# EAGLE design godwit-v01 (EAGLE 6.4)
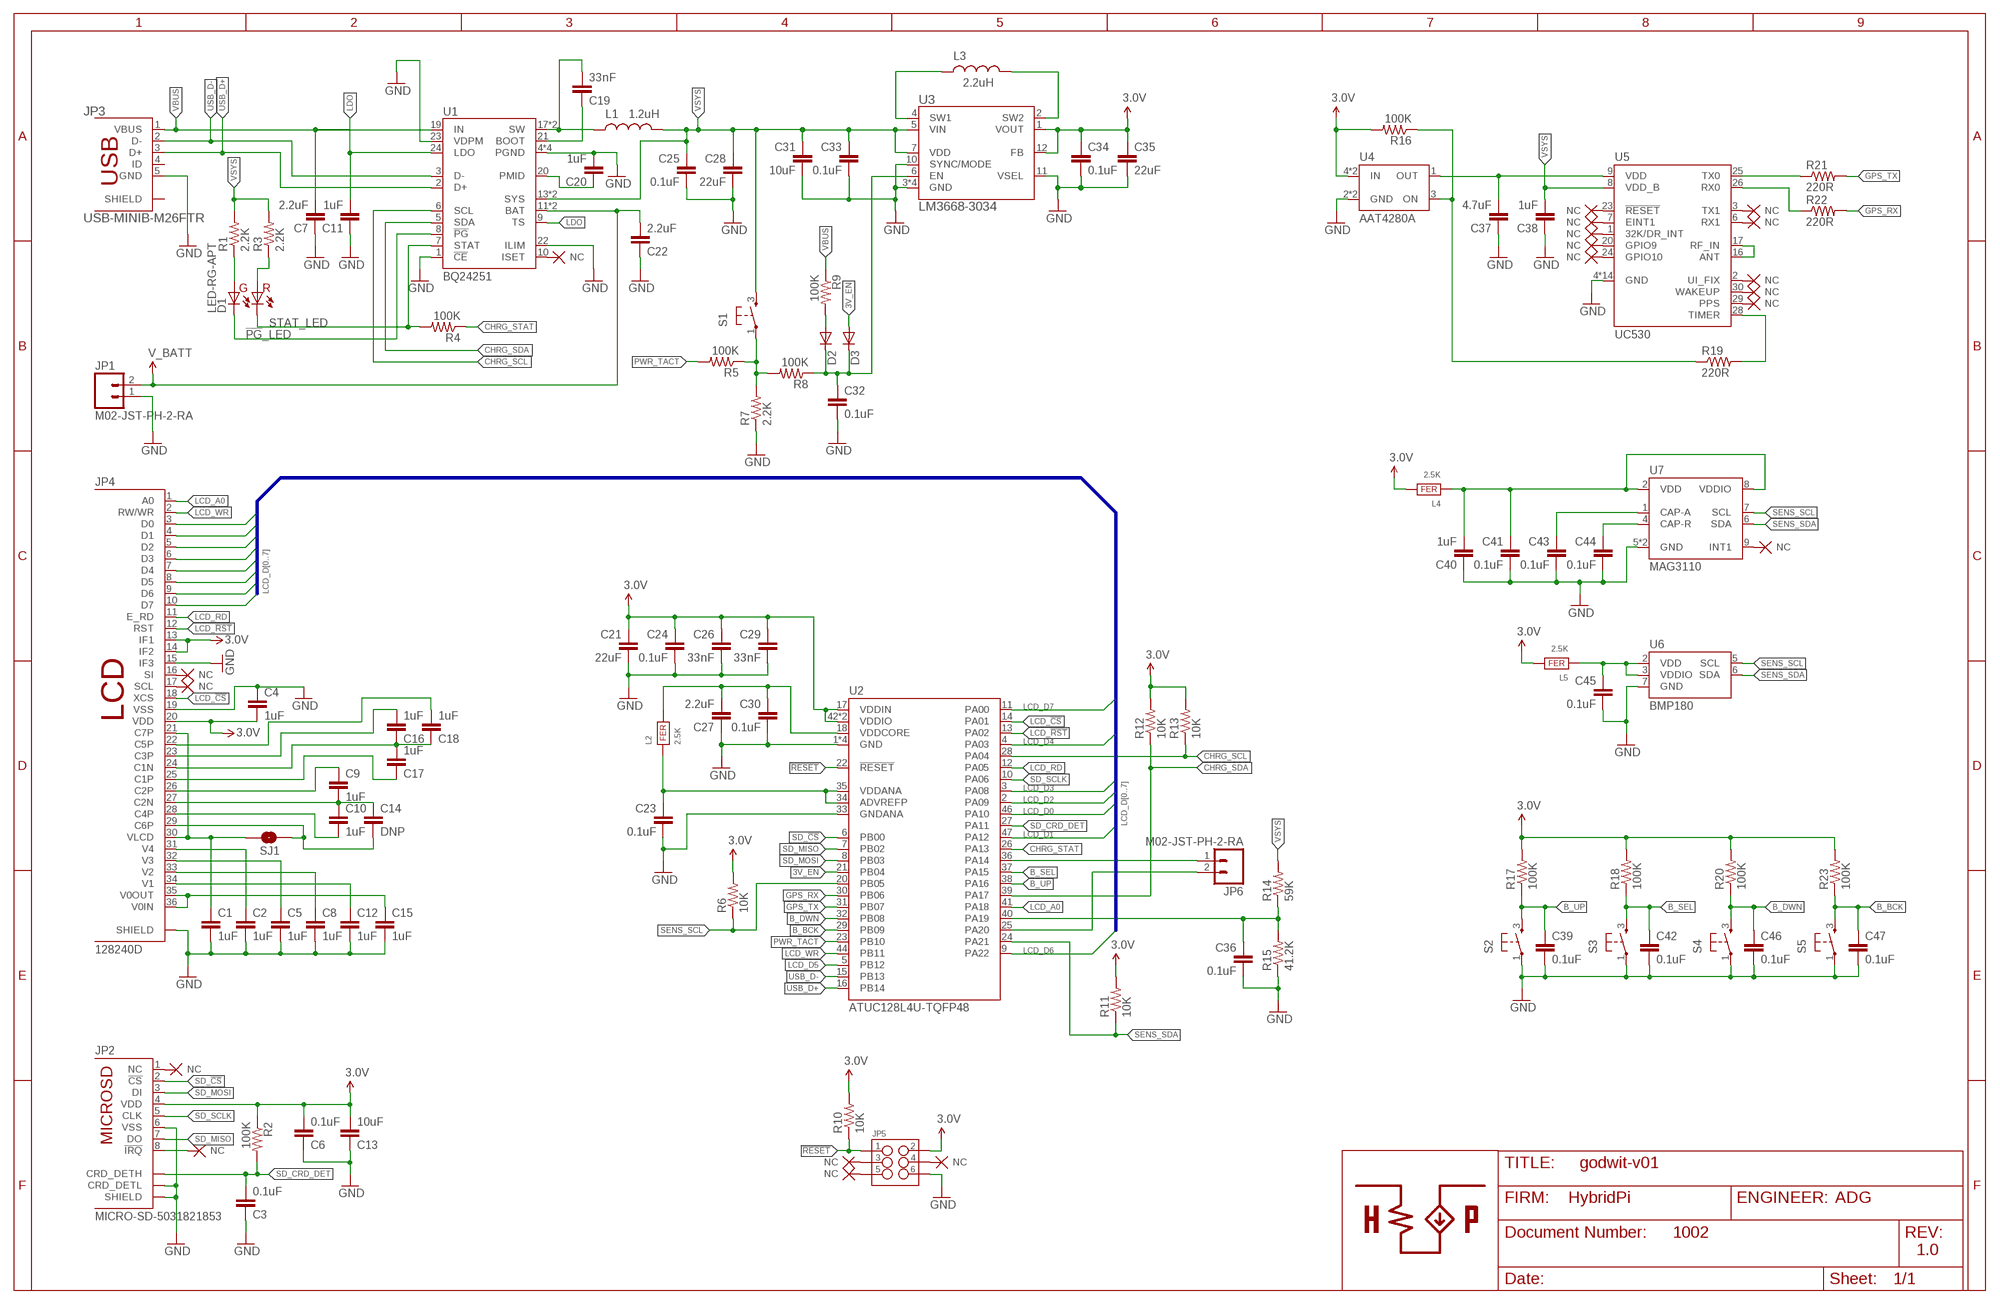
[diagram p0: schematic, sheet 1]

## Parts
C1  1uF  C-EUC0603  [C0603]
C2  1uF  C-EUC0603  [C0603]
C3  0.1uF  C-EUC0603  [C0603]
C4  1uF  C-EUC0603  [C0603]
C5  1uF  C-EUC0603  [C0603]
C6  0.1uF  C-EUC0603  [C0603]
C7  2.2uF  C-EUC0603  [C0603]
C8  1uF  C-EUC0603  [C0603]
C9  1uF  C-EUC0603  [C0603]
C10  1uF  C-EUC0603  [C0603]
C11  1uF  C-EUC0603  [C0603]
C12  1uF  C-EUC0603  [C0603]
C13  10uF  C-EUC0805  [C0805]
C14  DNP  C-EUC0603  [C0603]
C15  1uF  C-EUC0603  [C0603]
C16  1uF  C-EUC0603  [C0603]
C17  1uF  C-EUC0603  [C0603]
C18  1uF  C-EUC0603  [C0603]
C19  33nF  C-EUC0603  [C0603]
C20  1uF  C-EUC0603  [C0603]
C21  22uF  C-EUC0805  [C0805]
C22  2.2uF  C-EUC0603  [C0603]
C23  0.1uF  C-EUC0603  [C0603]
C24  0.1uF  C-EUC0603  [C0603]
C25  0.1uF  C-EUC0603  [C0603]
C26  33nF  C-EUC0603  [C0603]
C27  2.2uF  C-EUC0603  [C0603]
C28  22uF  C-EUC0805  [C0805]
C29  33nF  C-EUC0603  [C0603]
C30  0.1uF  C-EUC0603  [C0603]
C31  10uF  C-EUC0805  [C0805]
C32  0.1uF  C-EUC0603  [C0603]
C33  0.1uF  C-EUC0603  [C0603]
C34  0.1uF  C-EUC0603  [C0603]
C35  22uF  C-EUC0805  [C0805]
C36  0.1uF  C-EUC0603  [C0603]
C37  4.7uF  C-EUC0603  [C0603]
C38  1uF  C-EUC0603  [C0603]
C39  0.1uF  C-EUC0603  [C0603]
C40  1uF  C-EUC0603  [C0603]
C41  0.1uF  C-EUC0603  [C0603]
C42  0.1uF  C-EUC0603  [C0603]
C43  0.1uF  C-EUC0603  [C0603]
C44  0.1uF  C-EUC0603  [C0603]
C45  0.1uF  C-EUC0603  [C0603]
C46  0.1uF  C-EUC0603  [C0603]
C47  0.1uF  C-EUC0603  [C0603]
D1  LED-RG-APT  [LED-2-1.6X1.25]
D2  1N4148X-TP  DIODESOD523  [SOD523]
D3  1N4148X-TP  DIODESOD523  [SOD523]
JP1  M02-JST-PH-2-RA  [JST-PH-2-RA]
JP2  MICRO-SD-5031821853  [MICROSD-5031821853]
JP3  USB-MINIB-M26FTR  [USB-MINIB-M26FTR]
JP4  128240D  [128240D]
JP5  M03X2NO_SILK  [2X3-NS]
JP6  M02-JST-PH-2-RA  [JST-PH-2-RA]
L1  1.2uH  INDUCTOR-SRU5028  [SRU5028]
L2  2.5K  FERRITE-BEAD-0603  [0603]
L3  2.2uH  INDUCTOR-SRU5028  [SRU5028]
L4  2.5K  FERRITE-BEAD-0603  [0603]
L5  2.5K  FERRITE-BEAD-0603  [0603]
R1  2.2K  R-US_R0603  [R0603]
R2  100K  R-US_R0603  [R0603]
R3  2.2K  R-US_R0603  [R0603]
R4  100K  R-US_R0603  [R0603]
R5  100K  R-US_R0603  [R0603]
R6  10K  R-US_R0603  [R0603]
R7  2.2K  R-US_R0603  [R0603]
R8  100K  R-US_R0603  [R0603]
R9  100K  R-US_R0603  [R0603]
R10  10K  R-US_R0603  [R0603]
R11  10K  R-US_R0603  [R0603]
R12  10K  R-US_R0603  [R0603]
R13  10K  R-US_R0603  [R0603]
R14  59K  R-US_R0603  [R0603]
R15  41.2K  R-US_R0603  [R0603]
R16  100K  R-US_R0603  [R0603]
R17  100K  R-US_R0603  [R0603]
R18  100K  R-US_R0603  [R0603]
R19  220R  R-US_R0603  [R0603]
R20  100K  R-US_R0603  [R0603]
R21  220R  R-US_R0603  [R0603]
R22  220R  R-US_R0603  [R0603]
R23  100K  R-US_R0603  [R0603]
S1  FSMRA7JH  TAC_SWITCH-FSMRA  [FSMRA]
S2  FSMRA7JH  TAC_SWITCH-FSMRA  [FSMRA]
S3  FSMRA7JH  TAC_SWITCH-FSMRA  [FSMRA]
S4  FSMRA7JH  TAC_SWITCH-FSMRA  [FSMRA]
S5  FSMRA7JH  TAC_SWITCH-FSMRA  [FSMRA]
SJ1  SOLDERJUMPERNC  [SJ_2S]
U1  BQ24251  [VQFN-24]
U2  ATUC128L4U-TQFP48  [TQFP48]
U3  LM3668-3034  [WSON-12]
U4  AAT4280A  [SOT23-6]
U5  UC530  [UC530]
U6  BMP180  [BMP180]
U7  MAG3110  [DFN-10-2X2]
U$2  NC  (no package)
U$3  NC  (no package)
U$4  NC  (no package)
U$5  NC  (no package)
U$6  NC  (no package)
U$7  NC  (no package)
U$8  NC  (no package)
U$9  NC  (no package)
U$10  NC  (no package)
U$11  NC  (no package)
U$12  NC  (no package)
U$13  NC  (no package)
U$14  NC  (no package)
U$16  NC  (no package)
U$17  NC  (no package)
U$18  NC  (no package)
U$19  NC  (no package)
U$20  NC  (no package)
U$80  NC  (no package)

## Nets
3.0V: C4.2 C6.2 C13.2 C21.1 C24.1 C26.1 C29.1 C34.1 C35.1 JP2.4(VDD) JP4.13(IF1) JP4.14(IF2) JP4.20(VDD) JP5.2 L4.2 L5.2 R2.1 R6.2 R10.2 R11.2 R12.2 R13.2 R16.2 R17.2 R18.2 R20.2 R23.2 U2.17(VDDIN) U2.42(VDDIO) U2.48(VDDIO) U3.1(VOUT) U3.12(FB) U4.4(IN) U4.6(IN)
3V_EN: D3.A U2.21(PB04)
!PG!_LED: D1.4(CG) U1.8(!PG!)
!RESET!: JP5.1 R10.1 U2.22(!RESET!)
B_BCK: C47.1 R23.1 S5.3 U2.29(PB09)
B_DWN: C46.1 R20.1 S4.3 U2.32(PB08)
B_SEL: C42.1 R18.1 S3.3 U2.37(PA15)
B_UP: C39.1 R17.1 S2.3 U2.38(PA16)
CHRG_SCL: R13.1 U1.6(SCL) U2.28(PA04)
CHRG_SDA: R12.1 U1.5(SDA) U2.39(PA17)
CHRG_STAT: R4.1 U2.26(PA13)
GND: C1.2 C2.2 C3.1 C4.1 C5.2 C6.1 C7.1 C8.2 C11.1 C12.2 C13.1 C15.2 C20.2 C21.2 C22.1 C23.2 C24.2 C25.2 C26.2 C27.1 C28.2 C29.2 C30.2 C31.2 C32.2 C33.2 C34.2 C35.2 C36.2 C37.1 C38.1 C39.2 C40.1 C41.2 C42.2 C43.2 C44.2 C45.2 C46.2 C47.2 JP1.1 JP2.6(VSS) JP2.CRD_DETL JP2.SHIELD1(SHIELD) JP2.SHIELD2(SHIELD) JP2.SHIELD3(SHIELD) JP2.SHIELD4(SHIELD) JP2.SHIELD5(SHIELD) JP3.5(GND) JP4.15(IF3) JP4.19(VSS) JP4.SHIELD1(SHIELD) JP4.SHIELD2(SHIELD) JP5.6 R7.1 R15.1 S2.1 S3.1 S4.1 S5.1 U1.1(!CE!) U1.4(PGND) U1.15(PGND) U1.16(PGND) U1.22(ILIM) U1.23(VDPM) U1.PAD(PGND) U2.1(GND) U2.19(GND) U2.33(GNDANA) U2.43(GND) U2.45(GND) U3.3(GND) U3.8(GND) U3.9(GND) U3.10(SYNC/MODE) U3.11(VSEL) U3.PAD(GND) U4.2(GND) U4.5(GND) U5.4(GND) U5.5(GND) U5.10(GND) U5.11(GND) U5.12(GND) U5.13(GND) U5.14(GND) U5.15(GND) U5.18(GND) U5.19(GND) U5.21(GND) U5.22(GND) U5.27(GND) U5.31(GND) U6.7(GND) U7.5(GND) U7.10(GND)
GPS_RX: R22.2 U2.30(PB06)
GPS_TX: R21.2 U2.31(PB07)
LCD_!CS!: JP4.18(XCS) U2.14(PA01)
LCD_!RST!: JP4.12(RST) U2.13(PA02)
LCD_A0: JP4.1(A0) U2.41(PA18)
LCD_D0: JP4.3(D0) U2.46(PA10)
LCD_D1: JP4.4(D1) U2.47(PA12)
LCD_D2: JP4.5(D2) U2.2(PA09)
LCD_D3: JP4.6(D3) U2.3(PA08)
LCD_D4: JP4.7(D4) U2.4(PA03)
LCD_D5: JP4.8(D5) U2.5(PB12)
LCD_D6: JP4.9(D6) U2.9(PA22)
LCD_D7: JP4.10(D7) U2.11(PA00)
LCD_RD: JP4.11(E_RD) U2.12(PA05)
LCD_WR: JP4.2(RW/WR) U2.44(PB11)
LDO: C11.2 U1.9(TS) U1.24(LDO)
N$1: L3.2 U3.2(SW2)
N$2: L3.1 U3.4(SW1)
N$3: C19.1 U1.21(BOOT)
N$4: U5.16(ANT) U5.17(RF_IN)
N$5: C19.2 L1.1 U1.17(SW) U1.18(SW)
N$6: C20.1 U1.20(PMID)
N$7: U1.10(ISET) U$80.NC
N$8: D2.A R9.2
N$9: C32.1 D2.C D3.C R8.1 U3.6(EN)
N$10: U5.3(TX1) U$2.NC
N$11: U5.6(RX1) U$3.NC
N$12: U5.29(PPS) U$4.NC
N$13: U5.7(EINT1) U$5.NC
N$14: U5.1(32K/DR_INT) U$6.NC
N$15: D1.3(AG) R1.1
N$16: U5.20(GPIO9) U$7.NC
N$17: U5.24(GPIO10) U$8.NC
N$18: D1.1(AR) R3.1
N$19: U5.30(WAKEUP) U$11.NC
N$20: U5.2(UI_FIX) U$9.NC
N$21: U5.23(!RESET!) U$10.NC
N$22: C37.2 U4.1(OUT) U5.9(VDD)
N$23: R21.1 U5.25(TX0)
N$24: R22.1 U5.26(RX0)
N$25: R19.2 U5.28(TIMER)
N$26: R16.1 R19.1 U4.3(ON)
N$27: C9.2 C10.1 C14.1 JP4.27(C2N)
N$28: C44.1 U7.4(CAP-R)
N$29: C43.1 U7.1(CAP-A)
N$30: JP2.1(NC) U$13.NC
N$31: JP2.8(!IRQ!) U$14.NC
N$32: U7.9(INT1) U$12.NC
N$33: C9.1 JP4.26(C2P)
N$34: C10.2 JP4.28(C4P)
N$35: C14.2 JP4.29(C6P) SJ1.2
N$36: C16.1 C17.2 C18.1 JP4.24(C1N)
N$37: C17.1 JP4.25(C1P)
N$38: C16.2 JP4.23(C3P)
N$39: C18.2 JP4.22(C5P)
N$40: C2.1 JP4.31(V4)
N$41: C5.1 JP4.32(V3)
N$42: C1.1 JP4.21(C7P) JP4.30(VLCD) SJ1.1
N$43: C8.1 JP4.33(V2)
N$44: C12.1 JP4.34(V1)
N$45: C15.1 JP4.35(V0OUT) JP4.36(V0IN)
N$46: C36.1 R14.1 R15.2 U2.40(PA19)
N$47: JP6.1 U2.36(PA14)
N$48: C45.1 L5.1 U6.2(VDD) U6.3(VDDIO)
N$49: JP6.2 U2.25(PA20)
N$50: C23.1 L2.1 U2.34(ADVREFP) U2.35(VDDANA)
N$51: JP4.17(SCL) U$16.NC
N$52: JP4.16(SI) U$17.NC
N$53: C27.2 C30.1 L2.2 U2.18(VDDCORE)
N$54: C40.2 C41.1 L4.1 U7.2(VDD) U7.8(VDDIO)
N$55: JP5.3 U$18.NC
N$56: JP5.5 U$19.NC
N$57: JP5.4 U$20.NC
N$88: R5.1 R7.2 R8.2 S1.1
PWR_TACT: R5.2 U2.23(PB10)
SD_!CS!: JP2.2(!CS!) U2.6(PB00)
SD_CRD_DET: C3.2 JP2.CRD_DETH R2.2 U2.27(PA11)
SD_MISO: JP2.7(DO) U2.7(PB02)
SD_MOSI: JP2.3(DI) U2.8(PB03)
SD_SCLK: JP2.5(CLK) U2.10(PA06)
SENS_SCL: R6.1 U2.20(PB05) U6.5(SCL) U7.7(SCL)
SENS_SDA: R11.1 U2.24(PA21) U6.6(SDA) U7.6(SDA)
STAT_LED: D1.2(CR) R4.2 U1.7(STAT)
USB_D+: JP3.3(D+) U1.2(D+) U2.16(PB14)
USB_D-: JP3.2(D-) U1.3(D-) U2.15(PB13)
V_BATT: C22.2 JP1.2 U1.11(BAT) U1.12(BAT)
VBUS: C7.2 JP3.1(VBUS) R9.1 U1.19(IN)
VSYS: C25.1 C28.1 C31.1 C33.1 C38.2 L1.2 R1.2 R3.2 R14.2 S1.3 U1.13(SYS) U1.14(SYS) U3.5(VIN) U3.7(VDD) U5.8(VDD_B)
Unconnected: JP3.4(ID) JP3.SHIELD1(SHIELD) JP3.SHIELD2(SHIELD) JP3.SHIELD3(SHIELD) JP3.SHIELD4(SHIELD)

## Buses
LCD_D[0..7]

## Notes on the sheet
- ADG
- 1002
- 1.0

## Library data of the parts
C1 C2 C4 C5 C8-C10 C12 C14-C18 = hybridpi-rcl:C-EU: CAPACITOR, European symbol; VENDOR: DIGI-KEY; VENDOR_PN: 587-1248-1-ND
C3 C6 C23-C26 C29 C30 C32-C34 C36 C39 C41-C47 = hybridpi-rcl:C-EU: CAPACITOR, European symbol
C7 C22 C27 = hybridpi-rcl:C-EU: CAPACITOR, European symbol; VENDOR: DIGI-KEY; VENDOR_PN: 445-5167-1-ND
C11 C20 C38 C40 = hybridpi-rcl:C-EU: CAPACITOR, European symbol; VOLTAGE: >=10V
C13 C31 = hybridpi-rcl:C-EU: CAPACITOR, European symbol; VENDOR: DIGI-KEY; VENDOR_PN: 490-6470-1-ND
C19 = hybridpi-rcl:C-EU: CAPACITOR, European symbol; VOLTAGE: >15
C21 C28 C35 = hybridpi-rcl:C-EU: CAPACITOR, European symbol; VENDOR: DIGI-KEY; VENDOR_PN: 587-1305-1-ND
C37 = hybridpi-rcl:C-EU: CAPACITOR, European symbol; VENDOR: DIGI-KEY; VENDOR_PN: 490-3297-1-ND; VOLTAGE: >=10V
D1 = hybridpi-opto:LED-RG: BI-COLOR (RG) SMD CHIP LED APTB1612ESGC-F01 [APT] : Datasheet <http://www.us.kingbright.com/images/catalog/SPEC/APTB1612ESGC-F01.pdf>; EAGLEUP: LED-1p6x1p25; VENDOR: DIGI-KEY; VENDOR_PN: 754-1146-1-ND
D2 D3 = hybridpi-discrete-semi:DIODE: Diode These are standard reverse protection diodes and small signal diodes. SMA package can handle up to about 1A. SOD-323 can handle about 200mA. What the SOD-323 package when ordering, there are some mfgs out there that are 5-pin packages.; VENDOR: DIGI-KEY; VENDOR_PN: 1N4148XTPMSCT-ND
JP1 JP6 = hybridpi-connector:M02: Standard 2-pin header.; EAGLEUP: JST-PH-2-RA; VENDOR: DIGI-KEY; VENDOR_PN: 455-1719-ND
JP2 = hybridpi-connector:MICRO-SD: MicroSD Memory Card Connector, Ultra Low-Profile, Push-Push Type, 1.45mm Height, Anti-card fly-out Datasheet: 5031821853 <http://www.molex.com/pdm_docs/sd/5031821853_sd.pdf>; EAGLEUP: MICROSD-5031821853; VENDOR: DIGI-KEY; VENDOR_PN: WM9750CT-ND
JP3 = hybridpi-connector:USB-MINIB: USB MINIB Connector USB-M26FTR: Datasheet <http://www.on-shore.com/sites/default/files/manuals/USB-M2XFXX.pdf>; EAGLEUP: USB-MINIB; VENDOR: DIGI-KEY; VENDOR_PN: ED2992CT-ND
JP4 = hybridpi-connector:128240D: ZIF Connector for 128x240 Monochrome Graphic LCD Datasheet: 128249D <https://www.displaytech-us.com/sites/default/files/display-data-sheet/128240D%20series-v12.pdf> Connector: SEA8056-36 <https://www.displaytech-us.com/sites/default/files/zif-connector/SEAComp%200.5mm%20ZIF%20Connector%20for%20LCD_1.pdf>; EAGLEUP: 128240D_CON; VENDOR: MOUSER; VENDOR_PN: 758-SEA8056-36
JP5 = hybridpi-connector:M03X2: 2x3 .1" header. Shrouded, with keying- CONN-10681 SMT- CONN-11415 Pogo pins- HW-11044; EAGLEUP: M03X2
L1 L3 = hybridpi:INDUCTOR: Inductor SRN6045: Datasheet <http://www.bourns.com/data/global/pdfs/SRN6045.pdf> SRN4018: Datasheet <http://www.bourns.com/data/global/pdfs/SRN4018.pdf> SRU5028: Datasheet <http://bourns.com/data/global/pdfs/SRU5028.pdf>
L2 L4 L5 = hybridpi:FERRITE-BEAD: Ferrite Bead; EAGLEUP: F0603; VENDOR: DIGI-KEY; VENDOR_PN: 587-1893-1-ND
R1-R23 = hybridpi-rcl:R-US_: RESISTOR, American symbol
S1-S5 = hybridpi-electromechanical:TAC_SWITCH: Momentary Switch Button commonly used for reset or general input. Spark Fun Electronics SKU : COM-00097 SMT- SWCH-08247; EAGLEUP: TACTILE-PTH-FSMRA7JH; VENDOR: DIGI-KEY; VENDOR_PN: 450-1661-ND
SJ1 = hybridpi-passive:SOLDERJUMPER: Solder Jumper Standard SMD solder jumper. Used to automate production. Two varients : Normally Open and Normally Closed are the same, but have different paste layers. NC will have a large amount of paste and should jumper during reflow.
U1 = hybridpi:BQ24251: 2A I2C Switching Li-Ion Battery Charger With automatic USB current limiting Datasheet: BQ24251 <http://www.ti.com/lit/ds/slusba1b/slusba1b.pdf>; VENDOR: DIGI-KEY; VENDOR_PN: 296-36444-1-ND
U2 = hybridpi-digitalic:ATUC*L: 32-bit Atmel® AVR® Microcontroller, 128KB Flash, 48-pin, USB Full-speed Device, CAT Module, FlashVault code protection Datasheet: ATUCLXU <http://www.atmel.com/Images/Atmel-32142-32-bit-Flash-MCU-ATUCL3U-L4U_datasheet.pdf>; VENDOR: DIGI-KEY; VENDOR_PN: ATUC128L4U-AUT-ND
U3 = hybridpi:LM3668: 1A Buck-Boost DC/DC Converter Internal FETs Datsheet: LM3668 <http://www.ti.com/lit/ds/symlink/lm3668.pdf>; EAGLEUP: WSON-12-3p1x3p1; VENDOR: DIGI-KEY; VENDOR_PN: LM3668SD-3034/NOPBCT-ND
U4 = hybridpi-poweric:AAT4280A: 2.3A Slew Rate Controlled Load Switch Datasheet: AAT4280A <http://www.skyworksinc.com/uploads/documents/202230A.pdf>; VENDOR: DIGI-KEY; VENDOR_PN: 863-1486-1-ND
U5 = hybridpi-rf:UC530: Fastrax GPS antenna module Datasheet: UC530 <http://www.u-blox.com/images/downloads/Product_Docs/UC530_DataSheet_(FTX-HW-12009).pdf>; EAGLEUP: UC530; VENDOR: MOUSER; VENDOR_PN: 916-UC530
U6 = hybridpi-sensor:BMP180: Digital (I2C) Pressure Sensor Datasheet: BMP180 <http://ae-bst.resource.bosch.com/media/products/dokumente/bmp180/BST-BMP180-DS000-08.pdf>; EAGLEUP: BMP180; VENDOR: DIGI-KEY; VENDOR_PN: 828-1027-1-ND
U7 = hybridpi-sensor:MAG3110: Three-Axis, Digital MAG3110 Magnetometer Datasheet: MAG3110 <http://cache.freescale.com/files/sensors/doc/data_sheet/MAG3110.pdf>; EAGLEUP: DFN-10-2x2; VENDOR: DIGI-KEY; VENDOR_PN: MAG3110FCR1CT-ND
U$2-U$14 U$16-U$20 U$80 = hybridpi-aesthetics:NC: No Connect [NC]; _EXTERNAL_: _EXTERNAL_

## Board
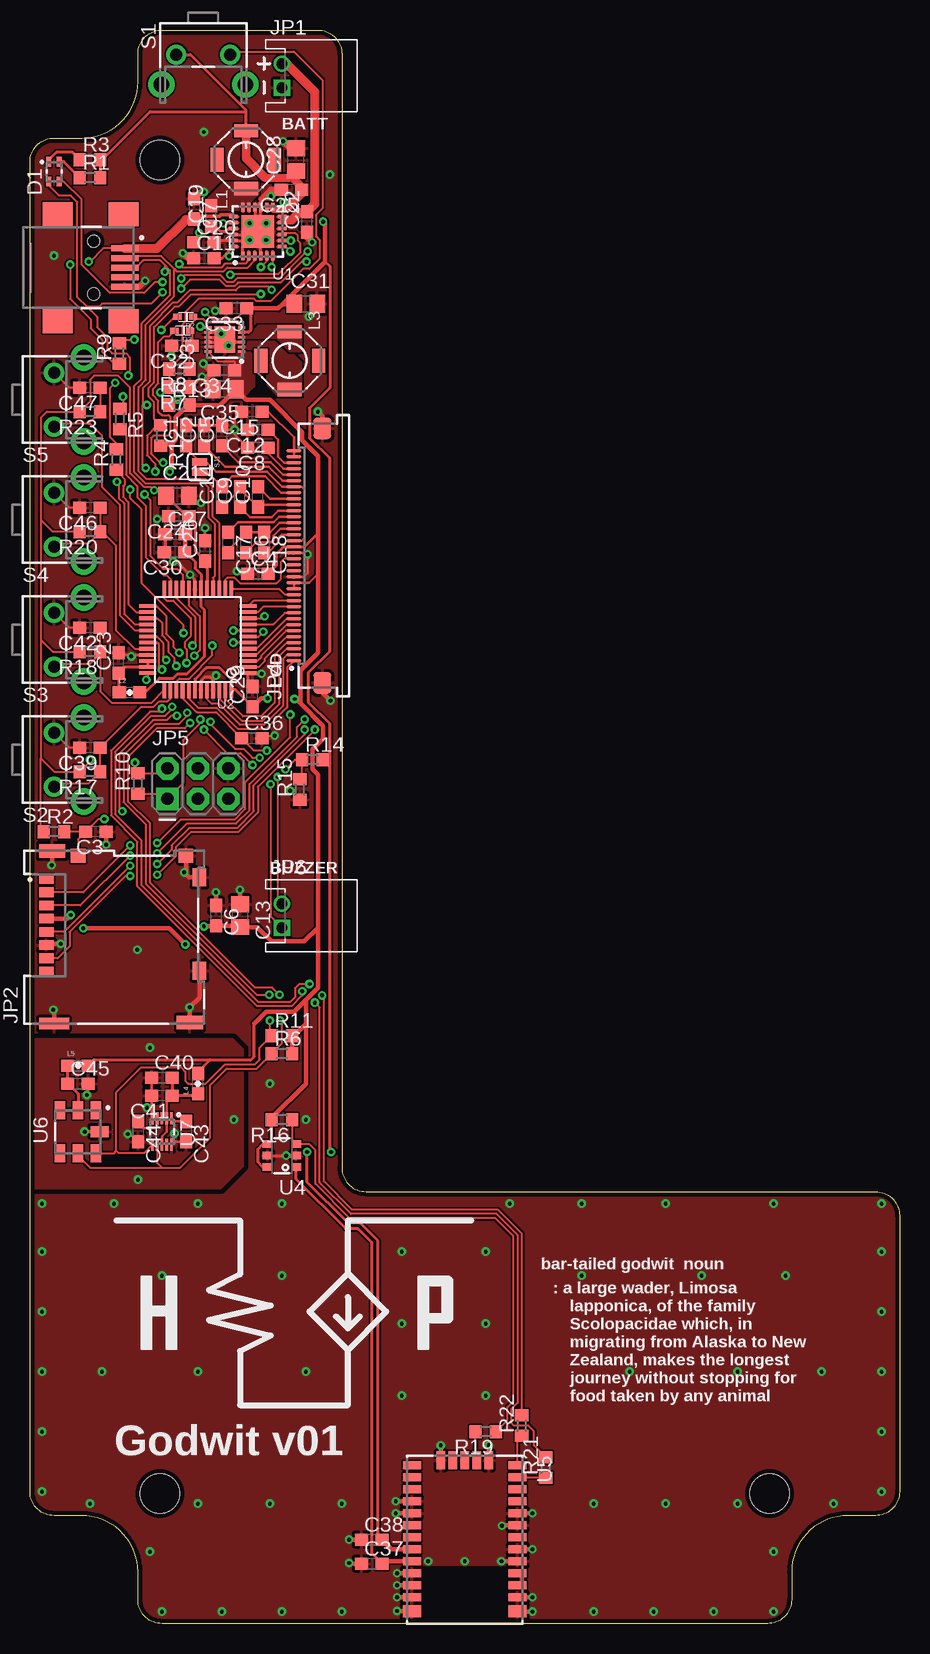
[diagram p1: board, top side]
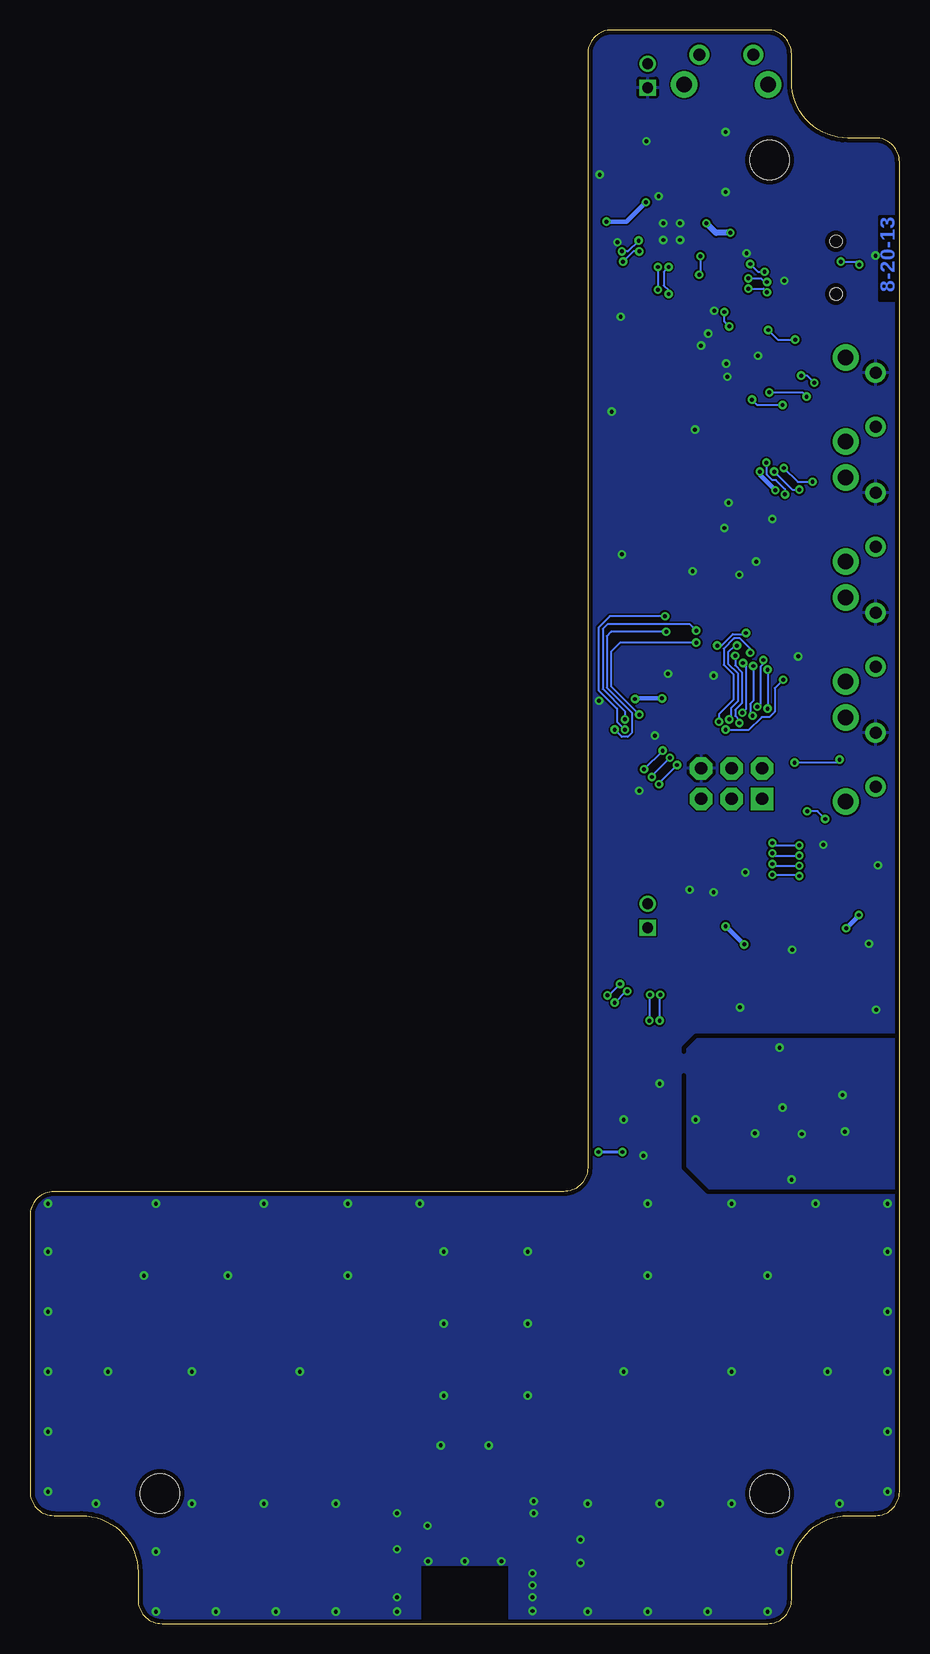
[diagram p2: board, bottom side, seen from below]

Size 72.5 x 132.8 mm. Coordinates in mm from the lower left corner, seen from the top.
Outline: 4.3,9 2,9 arc-90 0,11 0,121.8 arc-90 2,123.8 4.3,123.8 arc90 9,128.5 9,130.8 arc-90 11,132.8 24,132.8 arc-90 26,130.8 26,38 arc90 28,36 70.5,36 arc-90 72.5,34 72.5,11 arc-90 70.5,9 68.2,9 arc90 63.5,4.3 63.5,2 arc-90 61.5,0 11,0 arc-90 9,2 9,4.3 arc90 4.3,9
Copper layers (1*16): Top 0.0356mm / dielectric 1.5011mm / Bottom 0.0356mm
Design rules "OSHPark *": minimum track width 6mil, minimum drill 13mil, track to track 6mil, track to pad 6mil, pad to pad 6mil, via to via 6mil, smd to smd 6mil, copper to edge 15mil, drill to drill 6mil, minimum pad ring 7mil, minimum via ring 7mil, stop-mask expansion 4mil, vias tented up to drill 13mil, thermal gap 10mil
Holes 3.26 mm at 10.84,10.84 61.66,10.84 10.84,121.96
tKeepout: area 8,8 to 13.6,13.6; area 58.9,8 to 64.5,13.6; area 8,119.2 to 13.6,124.8
tRestrict: 7 lines
bRestrict: 7 lines

### Footprints (pad centres in the part's own frame; a part is rotated, then mirrored left to right if it is on the bottom)
C0603 = smd 1.1 x 1: 1 -0.85,0; 2 0.85,0
C0805 = smd 1.3 x 1.5: 1 -0.95,0; 2 0.95,0
LED-2-1.6X1.25 = smd 0.8 x 0.4: 1 0.825,0.43; 2 -0.825,0.43; 3 0.825,-0.43; 4 -0.825,-0.43
SOD523 = smd 0.7 x 0.5: A 0.7,0; C -0.6,0
JST-PH-2-RA = drill 0.9 square: 1 1,0 | drill 0.9: 2 -1,0
MICROSD-5031821853 = smd 0.8 x 1.24: 1 12.045,0.63; 2 10.945,0.63; 3 9.845,0.63; 4 8.745,0.63; 5 7.645,0.63; 6 6.545,0.63; 7 5.445,0.63; 8 4.345,0.63 | smd 1.16 x 1.25: CRD_DETH 13.985,-2 | smd 1.16 x 1.2: CRD_DETL 13.985,-11 | smd 0.95 x 2.5: SHIELD1 0,0 | smd 1.15 x 2.2: SHIELD2 0.1,-11.33; SHIELD5 14.39,0.15 | smd 1.5 x 1.15: SHIELD3 4.405,-12.125; SHIELD4 12.185,-12.125
USB-MINIB-M26FTR = smd 0.5 x 2.3: 1 -1.6,0.1; 2 -0.8,0.1; 3 0,0.1; 4 0.8,0.1; 5 1.6,0.1 | smd 2 x 2.5: SHIELD1 -4.45,0; SHIELD2 -4.45,-5.5; SHIELD3 4.45,0; SHIELD4 4.45,-5.5 | hole 1: -2.2,-2.5; 2.2,-2.5
128240D = smd 0.3 x 1.25: 1 -8.75,0; 2 -8.25,0; 3 -7.75,0; 4 -7.25,0; 5 -6.75,0; 6 -6.25,0; 7 -5.75,0; 8 -5.25,0; 9 -4.75,0; 10 -4.25,0; 11 -3.75,0; 12 -3.25,0; 13 -2.75,0; 14 -2.25,0; 15 -1.75,0; 16 -1.25,0; 17 -0.75,0; 18 -0.25,0; 19 0.25,0; 20 0.75,0; 21 1.25,0; 22 1.75,0; 23 2.25,0; 24 2.75,0; 25 3.25,0; 26 3.75,0; 27 4.25,0; 28 4.75,0; 29 5.25,0; 30 5.75,0; 31 6.25,0; 32 6.75,0; 33 7.25,0; 34 7.75,0; 35 8.25,0; 36 8.75,0 | smd 1.8 x 1.5: SHIELD1 -10.6,-2.375; SHIELD2 10.6,-2.375
2X3-NS = drill 1.016 pad 1.88 square: 1 -2.54,-1.27 | drill 1.016 pad 1.88 octagon: 2 -2.54,1.27; 3 0,-1.27; 4 0,1.27; 5 2.54,-1.27; 6 2.54,1.27
SRU5028 = smd 1.1 x 2: 1 -2.4,0; 2 2.4,0 | smd 2 x 1.1: 3 0,-2.4; 4 0,2.4
0603 = smd 1.1 x 1: 1 -0.85,0; 2 0.85,0
R0603 = smd 1 x 1.1: 1 -0.85,0; 2 0.85,0
FSMRA = drill 1 pad 1.676: 1 -2.25,0; 3 2.25,0 | drill 1.3 pad 2.184: SHIELD1 -3.5,2.49; SHIELD2 3.5,2.49
SJ_2S = smd 0.635 x 1.27: 1 -0.412,0; 2 0.412,0
VQFN-24 = smd 0.28 x 0.71: 1 1.251,2.044; 2 0.751,2.044; 3 0.251,2.044; 4 -0.249,2.044; 5 -0.749,2.044; 6 -1.249,2.044; 13 -1.251,-2.044; 14 -0.751,-2.044; 15 -0.251,-2.044; 16 0.249,-2.044; 17 0.749,-2.044; 18 1.249,-2.044 | smd 0.71 x 0.28: 7 -2.044,1.251; 8 -2.044,0.751; 9 -2.044,0.251; 10 -2.044,-0.249; 11 -2.044,-0.749; 12 -2.044,-1.249; 19 2.044,-1.251; 20 2.044,-0.751; 21 2.044,-0.251; 22 2.044,0.249; 23 2.044,0.749; 24 2.044,1.249 | smd 2.7 x 2.7: PAD 0,0
TQFP48 = smd 1.4 x 0.3: 1 -4.191,2.794; 2 -4.191,2.286; 3 -4.191,1.778; 4 -4.191,1.27; 5 -4.191,0.762; 6 -4.191,0.254; 7 -4.191,-0.254; 8 -4.191,-0.762; 9 -4.191,-1.27; 10 -4.191,-1.778; 11 -4.191,-2.286; 12 -4.191,-2.794; 25 4.191,-2.794; 26 4.191,-2.286; 27 4.191,-1.778; 28 4.191,-1.27; 29 4.191,-0.762; 30 4.191,-0.254; 31 4.191,0.254; 32 4.191,0.762; 33 4.191,1.27; 34 4.191,1.778; 35 4.191,2.286; 36 4.191,2.794 | smd 0.3 x 1.4: 13 -2.794,-4.191; 14 -2.286,-4.191; 15 -1.778,-4.191; 16 -1.27,-4.191; 17 -0.762,-4.191; 18 -0.254,-4.191; 19 0.254,-4.191; 20 0.762,-4.191; 21 1.27,-4.191; 22 1.778,-4.191; 23 2.286,-4.191; 24 2.794,-4.191; 37 2.794,4.191; 38 2.286,4.191; 39 1.778,4.191; 40 1.27,4.191; 41 0.762,4.191; 42 0.254,4.191; 43 -0.254,4.191; 44 -0.762,4.191; 45 -1.27,4.191; 46 -1.778,4.191; 47 -2.286,4.191; 48 -2.794,4.191
WSON-12 = smd 0.2 x 0.6: 1 -1,-1.405; 2 -0.6,-1.405; 3 -0.2,-1.405; 4 0.2,-1.405; 5 0.6,-1.405; 6 1,-1.405; 7 1,1.405; 8 0.6,1.405; 9 0.2,1.405; 10 -0.2,1.405; 11 -0.6,1.405; 12 -1,1.405 | smd 2.2 x 1.68: PAD 0,0
SOT23-6 = smd 0.63 x 0.8: 1 -0.95,-1.2; 2 0,-1.2; 3 0.95,-1.2; 4 0.95,1.2; 5 0,1.2; 6 -0.95,1.2
UC530 = smd 0.7 x 1.5: 1 -6.2,-4.4; 2 -5.2,-4.4; 3 -4.2,-4.4; 4 -3.2,-4.4; 5 -2.2,-4.4; 6 -1.2,-4.4; 7 -0.2,-4.4; 8 0.8,-4.4; 9 1.8,-4.4; 10 2.8,-4.4; 11 3.8,-4.4; 12 4.8,-4.4; 15 4.8,4.4; 16 3.8,4.4; 17 2.8,4.4; 18 1.8,4.4; 19 0.8,4.4; 20 -0.2,4.4; 21 -1.2,4.4; 22 -2.2,4.4; 23 -3.2,4.4; 24 -4.2,4.4; 25 -5.2,4.4; 26 -6.2,4.4 | smd 1 x 1.5: 13 5.95,-4.4; 14 5.95,4.4 | smd 1.5 x 0.7: 27 -6.6,2; 28 -6.6,1; 29 -6.6,0; 30 -6.6,-1; 31 -6.6,-2
BMP180 = smd 0.9 x 1.5: 1 1.5,1.8; 2 0,1.8; 3 -1.5,1.8; 4 -1.5,-1.8; 5 0,-1.8; 6 1.5,-1.8 | smd 1.5 x 0.9: 7 1.8,0
DFN-10-2X2 = smd 1 x 0.225: 1 -1.1,0.8; 2 -1.1,0.4; 3 -1.1,0; 4 -1.1,-0.4; 5 -1.1,-0.8; 6 1.1,-0.8; 7 1.1,-0.4; 8 1.1,0; 9 1.1,0.4; 10 1.1,0.8

### Placement (x,y rotation side)
C1  13,99 90 top
C2  14.5,99 90 top
C3  5.5,66 180 top
C4  19,87.5 0 top
C5  16,99 90 top
C6  15.5,59 270 top
C7  13.7,117.9 270 top
C8  19,98 180 top
C9  17.5,93.9 90 top
C10  19,93.9 90 top
C11  14.5,113.8 0 top
C12  19,99.5 180 top
C13  17.5,59 270 top
C14  16,93.9 90 top
C15  18.5,101 180 top
C16  18,90.1 270 top
C17  16.5,90.1 270 top
C18  19.5,90.1 270 top
C19  15.1,117.3 90 top
C20  14.5,115.1 0 top
C21  12.3,94 0 top
C22  23.1,116.8 90 top
C23  7.4,80.05 90 top
C24  12.4,92.3 180 top
C25  21.8,119.5 180 top
C26  14.6,89.4 90 top
C27  12.1,90.8 0 top
C28  22.2,122 90 top
C29  18.55,77.25 90 top
C30  12.05,89.3 180 top
C31  23,110 0 top
C32  12.65,106.5 180 top
C33  17.2,109.6 180 top
C34  16.2,104.45 180 top
C35  16.2,102.85 180 top
C36  18.5,73.8 0 top
C37  28.5,5 0 top
C38  28.5,7 0 top
C39  5,73 180 top
C40  11,45.5 0 top
C41  11,44 180 top
C42  5,83 180 top
C43  13,41 270 top
C44  9,41 270 top
C45  4,45 0 top
C46  5,93 180 top
C47  5,103 180 top
D1  2,121 90 top
D2  13,108.9 180 top
D3  12.75,107.75 180 top
JP1  21,129 270 top
JP2  2,50 90 top
JP3  7.8,113 270 top
JP4  22,89 90 top
JP5  14,70 0 top
JP6  21,59 270 top
L1  18,122 90 top
L2  8.3,77.6 0 top
L3  21.65,105.25 270 top
L4  14,45 90 top
L5  4,46.5 0 top
R1  5,120.5 0 top
R2  2,66 0 top
R3  5,122 0 top
R4  7.2,97 90 top
R5  7.5,100.4 270 top
R6  21,47.5 0 top
R7  12.45,103.05 180 top
R8  12.45,104.55 180 top
R9  7.45,105.85 90 top
R10  9,70 90 top
R11  21,49 0 top
R12  10.9,99 270 top
R13  12.45,101.55 0 top
R14  23.55,72 0 top
R15  22.5,69.5 90 top
R16  21,42 180 top
R17  5,71 180 top
R18  5,81 180 top
R19  38,16 180 top
R20  5,91 180 top
R21  43,13 90 top
R22  41,16.5 90 top
R23  5,101 180 top
S1  14.45,130.75 180 top
S2  2,72 270 top
S3  2,82 270 top
S4  2,92 270 top
S5  2,102 270 top
SJ1  14.15,96.4 270 top
U1  19,116 180 top
U2  14,82 180 top
U3  16.25,107 90 top
U4  21,39 90 top
U5  36.25,7 270 top
U6  4,41 0 top
U7  11,41 270 top
U$21  [LOGO_MED_SLK]  7,18 0 top

### Tracks (layer width: path | path; a pad name or v marks a point on that pad's centre or on a via)
3.0V  (via drill 0.33)
  Top 0.152: U3.1 17.66,105.06 C34.1 17.05,105.15 17,105.2 15.64,105.2 U3.12 | v10.35,94.45 10.1,94.7 9.5,94.7 8.35,95.85 8.35,103 7.35,104 5.35,104 5,103.65 5,101.85 R23.2 1.4,101 0.9,100.5 0.9,92 | 0.9,92 0.9,82 | 0.9,82 0.9,72.1 | R20.2 1.9,91 0.9,92 | 0.9,72.1 2,71 R17.2 5,71.85 v5,72 | 0.9,82 1.9,81 R18.2 | JP5.2 11.04,70.85 R10.2 8.75,71.1 v8.75,71.75 | R2.1 0.9,66.25 0.9,72.1
  Top 0.203: JP4.13 JP4.14 23.25,86.75 24,87.5 24,87.7
  Top 0.254: C29.1 17.14,77.81 U2.48 16.79,78.66 15.8,79.65 14.7,79.65 13.75,78.7 U2.42 | C26.1 14.36,88.31 14.76,87.91 U2.17 | C26.1 13.8,89.35 13.8,91.45 13.25,92 C24.1 | C26.1 14.7,88.65 | 24,90.8 23.95,90.8 22.9,89.75 JP4.20 21.15,89.75 20.5,89.1 20.5,88.15 C4.2 | 13.1,92.3 13.05,92.3 C21.1 | U4.6 19.4,38.05 19,38.45 19,39.55 19.4,39.95 U4.4 20.15,40.3 R16.2 | 15,47 5.35,47 L5.2 | L4.2 14,46 15,47 | 15,47 18.45,47 18.7,47.25 18.7,50
  Top 0.381: 22.55,76.7 22.55,79.45 24,80.9 24,87.7 24,90.8 24,97.3 22.7,98.6 22.7,99.3 20,102 18,102 C35.1 15.85,101.55 R13.2 13.15,101.55 12.15,100.55 12.15,98.65 11.8,98.3 | 22.5,77.05 v22.05,77.05 22.2,77.05 22.55,76.7 | v19.8,77.1 19.25,77.1 C29.1 | 13.55,92.6 C24.1 13.1,92.3 | 11.8,98.3 11.15,98.3 R12.2 | 11.4,94 C21.1 10.9,94.45 v10.35,94.45 | v11.65,96 11.8,96.15 11.8,98.3 | 18.7,50 19.7,51 22,51 23,52 | R6.2 R11.2 22,49 23,50 | 22.55,76.7 24.45,74.8 24.45,73.75 23.55,72.85 23.55,71.2 24,70.75 24,58 | 23,52 24,53 24,58 | R16.2 20.15,42.15 23,45 23,50 | 23,50 23,52 | 24,58 22.85,56.85 20.15,56.85 18.95,58.05 C13.2 17.4,58.15 C6.2 15.45,58.1 v14.5,58.1 | JP2.4 3.1,58.74 v3.4,59.05 | v4.45,57.95 11.6,57.95 v12.95,56.6
  Bottom 0.152: v5,72 5.25,71.75 v8.75,71.75
  Bottom 0.381: v22.05,77.05 22,77.1 v19.8,77.1 | v11.65,96 11.65,95.75 v10.35,94.45 | v14.5,58.1 13,56.6 v12.95,56.6 | v3.4,59.05 3.4,59 v4.45,57.95
  pour Top (rank 3, no thermals): 17.2,106.2 18.1,106.2 18.7,105.6 18.7,104.3 18.7,103.1 17.8,102.2 17.7,102.1 16.5,102.1 16.2,102.4 16.2,104.9 16.2,105.2
3V_EN  (via drill 0.33)
  Top 0.152: D3.A 11.55,107.25 11.15,107.25 10.7,106.8 10.7,103.35 10.25,102.9 10.25,102.35 10.7,101.9 10.7,101 11,100.7 11.55,100.7 11.7,100.55 11.7,99.2 11.5,99 10.3,99 10.1,98.8 10.1,97.5 10.85,96.75 v11.1,96.75 | v9.55,94.1 10,93.65 10,89 11.1,87.9 12.25,87.9 12.73,87.42 U2.21
  Bottom 0.152: v11.1,96.75 arc90 11.05,96.7 11.05,95.75 10.6,95.3 10.3,95.3 9.55,94.55 v9.55,94.1
!PG!_LED  (via drill 0.33)
  Top 0.152: U1.8 v21.75,115.25 | v23.15,114.35 23.05,114.35 20.8,112.1 17.25,112.1 16.95,111.8 16.45,111.8 15.9,112.35 12.85,112.35 v12.6,112.1 | v11.05,111.8 10.4,111.8 9.5,110.9 6.65,110.9 4.3,113.25 4.3,118.7 2.83,120.17 D1.4
  Bottom 0.152: v21.75,115.25 22.65,114.35 v23.15,114.35 | v12.6,112.1 11.55,112.1 11.25,111.8 v11.05,111.8
!RESET!  (via drill 0.33)
  Top 0.152: U2.22 12.22,85.43 13.75,83.9 13.75,81.75 13.55,81.55 v13.55,81.5 | R10.1 11.04,69.15 JP5.1 12.75,70.02 12.75,73.6 14.2,75.05 v14.2,75.35
  Bottom 0.152: v13.55,81.5 13.75,81.5 14.3,80.95 14.3,80 13.5,79.2 13.5,76.85 14.05,76.3 14.05,75.5 v14.2,75.35
B_BCK
  Top 0.152: 4.85,100 R23.1 C47.1 | 4.85,100 2.25,100 S5.3 | 4.85,100 5,100 6,99 6,94.7 7.5,93.2 7.5,84 8.74,82.76 U2.29
B_DWN
  Top 0.152: S4.3 2.25,90 4.85,90 R20.1 | C46.1 R20.1 | R20.1 6,91 7.15,89.85 7.15,82.8 8.71,81.24 U2.32
B_SEL
  Top 0.152: S3.3 2.25,80 5,80 5.85,80.85 | 5.85,80.85 R18.1 C42.1 | 5.85,80.85 5.85,77.7 6.8,76.75 10.15,76.75 U2.37
B_UP
  Top 0.152: S2.3 2.25,70 4.85,70 R17.1 C39.1 | U2.38 11.71,77.11 11.45,76.85 10.75,76.85 10.3,76.4 9.25,76.4 C39.1 | 5.9,73 C39.1
CHRG_SCL  (via drill 0.33)
  Top 0.152: U1.6 20.25,113.15 v20.15,113.05 | v20.15,111.15 19.9,111.4 17.45,111.4 17.15,111.1 13.3,111.1 12.3,110.1 11.95,110.1 10,108.15 10,103.55 9.4,102.95 9.4,101.55 | R13.1 11.85,101.55 v12.3,102 | v9.65,96.3 9.4,96.55 9.4,101.55 | U2.28 8.73,83.27 7.85,84.15 7.85,93.35 7.4,93.8 7.4,95 v7.25,95.15 | v9.75,101.55 9.4,101.55
  Bottom 0.152: v20.15,113.05 v20.15,111.15 | v9.75,101.55 11.85,101.55 v12.3,102 | v9.65,96.3 8.5,95.15 v7.25,95.15
CHRG_SDA  (via drill 0.33)
  Top 0.152: U1.5 19.75,113.55 v19.25,113.05 | v19.25,110.8 19.2,110.75 13.4,110.75 12.4,109.75 12.05,109.75 10.35,108.05 10.35,103.45 9.9,103 9.9,102.25 10.35,101.8 10.35,100.4 R12.1 10.6,99.85 9.75,99 9.75,97.35 10.45,96.65 v10.45,96 | U2.39 12.22,78.52 12.45,78.75 13.25,78.75 15.2,80.7 v15.2,81.5 | v12.8,82.55 12.8,83.2 9.3,86.7 9.3,92.85 8.35,93.8 v8.35,94.5
  Bottom 0.152: v19.25,113.05 19.65,112.65 19.65,111.5 19.25,111.1 v19.25,110.8 | v10.45,96 8.95,94.5 v8.35,94.5 | v15.2,81.5 14.85,81.5 13.9,82.45 12.9,82.45 v12.8,82.55
CHRG_STAT
  Top 0.152: R4.1 7.9,95.35 7.9,94.95 7.75,94.8 7.75,93.9 8.2,93.45 8.2,84.95 8.85,84.3 9.79,84.3 U2.26
GND  (via drill 0.33)
  Top 0.152: R7.1 13.5,103.05 v14.35,103.9 | C39.2 3.25,73 S2.1 | C46.2 3.25,93 S4.1 | C47.2 3.25,103 S5.1 | C42.2 3.25,83 S3.1 | R15.1 21.75,69.4 v21.7,69.4 | C36.2 19.55,74 v20.4,74 | U3.9 U3.10 15,106.8 | U3.11 14.95,106.5 v16.55,106.5
  Top 0.203: C1.2 C2.2 C5.2 16.35,99.5 v17.05,99.5 | 17.05,99.9 v17.05,99.5 | C12.2 v17.05,99.5 | C8.2 17.05,99.1 v17.05,99.5 | C15.2 17.05,100.4 v17.05,99.5 | JP4.19 23,89.25 v23.15,89.1 23.15,87.55 22.85,87.25 JP4.15 | C43.2 12.05,40.15 U7.10 11.95,40.05 11.95,40.45 12.05,40.55 v12.05,40.85 | C40.1 C41.2 10.15,43 | U7.5 10.15,42.15 10.15,43 | v9.75,43 10.15,43 | C44.2 8.35,40.8 v8.15,40.8
  Top 0.254: 19.3,118.7 19.25,118.65 19.25,118.54 | 19.25,118.54 U1.15 | U1.16 19.25,118.54 | 19.25,117.69 19.2,117.64 19.2,117 | 19.2,117 18.8,117.4 18.8,118 | 19.2,117 19.5,116.7 v19.7,116.7 | U1.PAD v18.3,115.3 | U1.22 17.85,115.75 v18.3,115.3 | v18.3,115.3 18.25,115.25 U1.23 15.5,115.25 C20.2 | 17.75,114.31 17.75,114.75 v18.3,115.3 | 19.25,114.31 19.25,114.85 v19.7,115.3 | U3.3 16.85,106.8 v16.55,106.5 16.25,106.8 U3.PAD 16.25,106.65 16,106.4 | U3.11 U3.10 U3.9 U3.8 15.85,107.6 v15.95,107.5 | U3.9 16.25,107.2 | U3.10 15,106.8 16.15,106.8 | U3.11 16.15,106.4 | C29.2 18.19,78.46 U2.1 18.25,79.15 v19.3,79.15 | U2.19 13.75,87 v13.35,87.4 12.25,88.5 v11.95,88.5 11.95,88.55 C30.2 11.25,89.35 C27.1 | C26.2 v14.6,91.3 | v17.25,87.7 17.95,87.7 arc-90 C4.1 | C24.2 11.45,92.3 11.2,92.05 v10.6,92.05 | C23.2 7.57,80.73 8.32,80.73 | 8.32,80.73 U2.33 | 8.32,80.73 v8.45,80.6 | U4.5 v21.35,39 | C45.2 4.75,44.9 v4.75,44.05 | U6.7 v4.55,41 | U2.43 14.25,78.55 14.55,78.85 15,78.85 15.25,78.6 | 15.25,78.6 15.25,78.75 v15.5,79 | 15.25,78.6 15.25,77.83 U2.45
  Top 0.381: JP4.SHIELD2 24.38,100.62 v24,101 | v14.25,93.4 13.85,93.4 C21.2 | C38.1 v26.6,7 | C37.1 26.65,5 v26.6,5.05 | U5.10 v30.6,4.2 | U5.11 v30.6,3.2 | U5.12 v30.6,2.2 | U5.13 v30.6,1.05 | U5.5 v30.5,9.2 | U5.4 v30.5,10.2 | U5.31 v34.25,14.85 | U5.27 v38.25,14.85 | U5.22 v41.9,9.2 | U5.21 39.4,8.2 v39.35,8.15 | U5.19 v41.9,6.2 | U5.18 v39.3,5.2 | U5.15 v41.9,2.2 | U5.14 40.65,1 v41.9,1 | U4.2 v21.35,39 | JP4.SHIELD1 24.38,77.58 v25.05,76.9 | JP2.SHIELD1 2,51.1 v1.95,51.15 | JP2.SHIELD2 13.33,51.32 v13.3,51.35 14.12,52.17 JP2.SHIELD3 | C6.1 v15.5,60.95 | C13.1 v17.5,61.15 | JP2.SHIELD4 13.27,62.19 v12.85,62.6 13,62.75 JP2.CRD_DETL | JP2.SHIELD5 1.85,63.25 v1.8,63.2 | C3.1 v6.35,64.9 | JP2.6 1.48,56.65 v2.55,56.65
  Top 0.508: C7.1 14.25,119.3 v14.5,119.3 | C11.1 13.65,113.65 13.3,113.65 v12.75,114.2 | 19.3,118.7 20.1,119.5 C25.2 21.1,119.35 | C28.2 21.68,122.95 v21.1,123.53 | C22.1 23.1,115.53 v23.52,115.11 | JP3.5 9.1,111.4 v9.6,111.9 | C33.2 16.15,109.4 v15.45,109.4 | C31.2 23.95,109.6 v23.25,108.9 | C35.2 15.25,103 v14.35,103.9 14.8,103.9 C34.2 15,104.45 v14.45,105 | C32.2 v11.8,105.65
  Top 0.686: C25.2 20.57,119.5 20.07,119
  other vias: 18.3,116.7 20.08,118.95 36.25,5.2 33.2,5.2 23,42 26,1 21,1 16,1 11,1 47,1 52,1 57,1 62,1 10,6 5,10 1,11 62,6 67,10 71,11 71,16 71,21 71,26 71,31 1,16 1,21 1,26 1,31 1,35 71,35 14,10 20,10 26,10 47,10 53,10 59,10 31,19 38,19 38,25 31,25 31,31 38,31 7,35 14,35 21,35 62,35 53,35 46,35 40,35 14,21 23,21 6,21 66,21 59,21 50,21 11,29 21,29 46,29 56,29 63,29 17,42 9,37 10,48 14.5,124.3 25,120.75 2,114 8.95,56.15 20,45
  pour Bottom (rank 6): 0,124 5,124 9,128 9,133 26,133 26,39 28,36 73,36 73,9 68,9 64,5 64,0 9,0 9,5 5,9 0,9
  pour Top (rank 6): 0,124 6,124 9,127 9,133 26,133 26,38 28,36 73,36 73,9 67,9 64,6 64,0 9,0 9,6 6,9 5,9 0,9
GPS_RX  (via drill 0.33)
  Top 0.152: R22.2 41,32.5 39,34.5 26.85,34.5 24.5,36.85 24.5,52.2 v24.35,52.35 | v23.3,53.3 22.45,53.3 22.1,52.95 22.1,52.2 21.7,51.8 19.05,51.8 9.3,61.55 9.3,65.25 7.1,67.45 7.1,72.65 10.1,75.65 11.25,75.65 11.85,76.25 v11.85,76.4 | U2.30 10.6,82.25 11.1,81.75 11.1,80.55 v11.35,80.3
  Bottom 0.152: v24.35,52.35 24.25,52.35 v23.3,53.3 | v11.35,80.3 11.35,80 11.6,79.75 11.6,76.65 v11.85,76.4
GPS_TX  (via drill 0.33)
  Top 0.152: R21.2 42,14.85 42,16.05 41.55,16.5 40.35,16.5 40.15,16.7 40.15,17.9 40.65,18.4 40.65,32.4 38.9,34.15 26.75,34.15 24.15,36.75 24.15,51.35 v23.75,51.75 | v22.7,52.7 22.7,52.35 21.8,51.45 18.95,51.45 8.95,61.45 8.95,65.15 6.75,67.35 6.75,72.75 10,76 10.75,76 v11,76.25 | U2.31 10.6,81.75 10.75,81.6 10.75,79.75 v11,79.5
  Bottom 0.152: v23.75,51.75 22.8,52.7 v22.7,52.7 | v11,79.5 v11,76.25
LCD_!CS!
  Top 0.152: JP4.18 21.2,88.75 20.9,88.45 20.9,87.05 20.55,86.7 17.5,86.7 17.05,87.15 16.45,87.15 16.29,86.99 U2.14
LCD_!RST!
  Top 0.152: JP4.12 21.25,85.75 20.81,86.19 U2.13
LCD_A0
  Top 0.152: JP4.1 21.45,79.7 21.45,76.35 19.65,74.55 17.35,74.55 15.6,76.3 14.05,76.3 13.24,77.11 U2.41
LCD_D0
  Top 0.152: JP4.3 21.4,81.25 20.75,80.6 20.75,76.6 19.4,75.25 17.65,75.25 15.78,77.12 U2.46
LCD_D1
  Top 0.152: JP4.4 21.4,81.75 20.4,80.75 20.4,76.75 19.25,75.6 17.75,75.6 16.29,77.06 U2.47
LCD_D2
  Top 0.152: JP4.5 21.4,82.25 19.55,80.4 19.55,80.2 19.06,79.71 U2.2 18.2,79.7
LCD_D3
  Top 0.152: JP4.6 21.35,82.75 19.25,80.65 19.25,80.5 18.97,80.22 U2.3 18.21,80.2
LCD_D4
  Top 0.152: U2.4 18.21,80.75 18.9,80.75 21.4,83.25 JP4.7
LCD_D5
  Top 0.152: U2.5 18.89,81.24 21.4,83.75 JP4.8
LCD_D6
  Top 0.152: U2.9 18.22,83.3 20.3,83.3 21.25,84.25 JP4.9
LCD_D7
  Top 0.152: JP4.10 19.45,84.75 19,84.3 18.2,84.3 U2.11
LCD_RD
  Top 0.152: JP4.11 18.65,85.25 U2.12
LCD_WR
  Top 0.152: JP4.2 21.45,80.75 21.1,80.4 21.1,76.5 19.5,74.9 17.5,74.9 15.75,76.65 15.15,76.65 14.76,77.04 U2.44
LDO  (via drill 0.33)
  Top 0.152: v16.6,113.95 16.6,114.39 16.6,114.4 | v16.7,112.4 16.75,112.45 20.7,112.45 22.55,114.3 22.55,115.05 22.35,115.25 22.35,115.65 22.15,115.85 21.14,115.85 U1.9 arc-90 21.09,115.8
  Top 0.254: C11.2 16,113.8 16.6,114.4 U1.24
  Bottom 0.152: v16.6,113.95 16.6,112.5 v16.7,112.4
N$1
  pour Top (rank 2, no thermals): 17.4,106.6 17.8,106.6 18.3,107.1 20.6,107.1 22.6,105.1 22.6,102.3 20.7,102.3 19.8,103.2 19.8,106.2 17.4,106.2
N$2
  pour Top (no thermals): 17.4,107.4 18.3,107.4 18.9,108 19.1,108.2 22.6,108.2 22.6,106 21.7,106 20.6,107.1 17.4,107.1
N$3
  Top 0.254: U1.21 16.55,116.25 16.3,116 15.9,116 15.45,116.45 C19.1
N$4
  Top 0.381: U5.17 40.8,4.2 41,4 41,3.2 U5.16
N$5
  pour Top (no thermals): 14.7,118.6 16.2,120.1 19,120.1 19,119.1 18.3,118.4 18.3,117.7 17.7,117.7 17.6,117.8 14.7,117.8
N$6  (via drill 0.33)
  Top 0.254: v16.1,116.7 16.15,116.75 U1.20
  Top 0.508: C20.1 14.1,115.55 v14.1,115.9
  Bottom 0.508: v14.1,115.9 15.3,115.9 v16.1,116.7
N$8  (via drill 0.33)
  Top 0.152: D2.A 12.05,108.9 v10.95,107.8 | R9.2 7.75,107 v8.7,107
  Bottom 0.152: v10.95,107.8 10.15,107 v8.7,107
N$9
  Top 0.152: U3.6 17.25,108.4 14.75,108.4 14.45,108.7 13.8,108.7 | 13.6,107.9 D3.C | D3.C 13.5,107.65 13.5,107 | 13.5,107 C32.1 | 13.8,108.7 D2.C | 13.8,108.7 13.35,108.25 D3.C | R8.1 13.3,106.8 13.5,107
N$15
  Top 0.254: R1.1 2.83,121.83 D1.3
N$18
  Top 0.254: R3.1 3.55,122.6 2.2,122.6 1.57,121.97 D1.1
N$22
  Top 0.254: C37.2 28.5,5.85 28.5,31.75 27.35,32.9 26.35,32.9 22.2,37.05 U4.1
  Top 0.381: U5.9 29.55,5.2 C37.2
N$23
  Top 0.152: U5.25 42.95,12.2 R21.1
N$24
  Top 0.152: U5.26 40.65,15.3 R22.1
N$25
  Top 0.152: U5.28 37.15,13.7 R19.2
N$26
  Top 0.152: R19.1 39.8,16.95 39.8,18.05 40.3,18.55 40.3,32.3 38.8,33.8 26.65,33.8 23.8,36.65 23.8,39.45 23.3,39.95 U4.3 21.85,40.3 R16.1
N$27
  Top 0.203: C9.2 17.5,94.55 | 17.5,94.55 C14.1 | 17.5,94.55 C10.1 19.2,93.25 JP4.27
N$28
  Top 0.203: C44.1 9.55,41.3 10.4,41.3 10.6,41.5 U7.4
N$29
  Top 0.203: C43.1 12.05,41.85 U7.1
N$33
  Top 0.203: C9.1 18.35,92.2 20.15,92.2 20.7,92.75 JP4.26
N$34
  Top 0.203: JP4.28 20,93.75 C10.2
N$35
  Top 0.203: JP4.29 20.95,94.25 19.6,95.6 16.85,95.6 C14.2 14.76,95.99 SJ1.2
N$36
  Top 0.203: JP4.24 20.8,91.75 20,90.95 C18.1 C16.1 16.5,89.45 C17.2
N$37
  Top 0.203: C17.1 17.35,91.8 20.3,91.8 20.75,92.25 JP4.25
N$38
  Top 0.203: C16.2 18.85,90.1 20.1,90.1 20.3,90.3 20.3,90.65 20.9,91.25 JP4.23
N$39
  Top 0.203: JP4.22 21,90.75 20.7,90.45 20.7,90.1 19.85,89.25 C18.2
N$40
  Top 0.203: JP4.31 21.05,95.25 19.9,96.4 16.25,96.4 C2.1
N$41
  Top 0.203: C5.1 17.35,96.8 20.05,96.8 21.1,95.75 JP4.32
N$42
  Top 0.203: JP4.21 22.65,90.25 22.9,90.5 22.9,94.5 22.65,94.75 JP4.30 21,94.75 19.75,96 15.5,96 14.69,96.81 SJ1.1 13,97.96 C1.1
N$43
  Top 0.203: C8.1 19.85,97.55 21.15,96.25 JP4.33
N$44
  Top 0.203: JP4.34 21.2,96.75 20.7,97.25 20.7,98.65 C12.1
N$45
  Top 0.203: JP4.35 JP4.36 22,98.85 19.85,101 C15.1
N$46  (via drill 0.33)
  Top 0.152: U2.40 12.73,77.12 13.9,75.95 15.5,75.95 C36.1 18.7,72.75 v19.75,72.75 | v21.3,71.2 22.1,72 R14.1 22.7,70.55 R15.2
  Bottom 0.152: v19.75,72.75 v21.3,71.2
N$47  (via drill 0.33)
  Top 0.152: U2.36 9.81,78.76 v9.7,78.65 | v14.5,74.5 16.45,72.55 17.55,72.55 v18.55,71.55 | v20.05,69.95 20.05,58.95 JP6.1
  Bottom 0.152: v9.7,78.65 10.4,77.95 10.4,76 10.85,75.55 11.5,75.55 12.6,74.45 14.45,74.45 v14.5,74.5 | v18.55,71.55 20.05,70.05 v20.05,69.95
N$48
  Top 0.254: U6.3 U6.2 4,44.15 C45.1 L5.1
N$49  (via drill 0.33)
  Top 0.152: U2.25 10.56,84.79 11.35,84 11.35,82.5 11.95,81.9 11.95,81.4 v12.45,80.9 | v15.05,75.15 15.05,74.95 17.1,72.9 17.8,72.9 18.55,72.15 v19.15,72.15 | v20.65,70.55 20.65,60.35 JP6.2
  Bottom 0.152: v12.45,80.9 12.45,81.25 13.3,82.1 13.8,82.1 14.65,81.25 14.65,79.9 13.85,79.1 13.85,77 15.05,75.8 v15.05,75.15 | v19.15,72.15 20.65,70.65 v20.65,70.55
N$50
  Top 0.254: U2.34 U2.35 7.91,79.71 C23.1 7.45,79.15 L2.1
N$53
  Top 0.254: C30.1 12.95,89.3 13.75,88.5 13.75,87.95 14.25,87.45 U2.18 | L2.2 9.6,77.6 10.8,78.8 11.95,78.8 12.3,79.15 13.1,79.15 14.55,80.6 14.55,84.45 14.25,84.75 U2.18 | U2.18
  Top 0.381: C30.1 12.95,89.35 C27.2
N$54
  Top 0.203: C41.1 11.4,43.55 U7.2 11.4,41 11,40.6 U7.8
  Top 0.254: C40.2 C41.1 13.85,44 L4.1
N$88  (via drill 0.33)
  Top 0.152: S1.1 16.95,131 22,131 24.4,128.6 24.4,117.95 23.85,117.4 23.85,115.6 24.15,115.3 24.15,113.75 23.3,112.9 22.75,112.9 20.05,110.2 18.9,110.2 18.7,110.4 14.05,110.4 12.95,109.3 12.95,108.5 12.7,108.25 12.7,105.65 R8.2 R7.2 11.3,103.05 v10.85,102.6 | v7.75,102.25 7.75,101.5 R5.1
  Bottom 0.152: v10.85,102.6 8.1,102.6 v7.75,102.25
PWR_TACT
  Top 0.152: U2.23 11.71,87.04 11.4,87.35 11.15,87.35 9.65,88.85 9.65,93.15 8.95,93.85 8.95,94.8 8,95.75 8,99.05 R5.2
SD_!CS!  (via drill 0.33)
  Top 0.152: U2.6 v16.95,81.75 | v21.7,75.75 21.7,73.85 17.95,70.1 17.95,67.9 17.05,67 12.55,67 v10.6,65.05 | v8.35,64.85 4.45,60.95 JP2.2
  Bottom 0.152: v16.95,81.75 23.3,81.75 24.05,81 24.05,78.1 v21.7,75.75 | v10.6,65.05 10.4,64.85 v8.35,64.85
SD_CRD_DET  (via drill 0.33)
  Top 0.152: U2.27 10.62,83.78 11,83.4 11,82.35 11.55,81.8 11.55,80.95 12,80.5 12,80 v12.2,79.8 | v12.25,75.65 11.75,75.65 11.4,75.3 10.25,75.3 7.45,72.5 7.45,67.95 v7.7,67.7 | v6.2,67.05 5.7,67.05 C3.2 | C3.2 4,65.35 JP2.CRD_DETH | C3.2 R2.2
  Bottom 0.152: v12.2,79.8 12.2,76.9 12.45,76.65 12.45,75.85 v12.25,75.65 | v6.2,67.05 6.85,67.7 v7.7,67.7
SD_MISO  (via drill 0.33)
  Top 0.152: U2.7 19.05,82.25 v19.45,82.65 | v23.75,74.5 19,69.75 19,67.6 17.35,65.95 13.4,65.95 12.15,64.7 12.15,63.95 v10.6,62.4 | v8.35,62.3 7.95,62.3 3.3,57.65 3.3,56.45 2.29,55.45 JP2.7
  Bottom 0.152: v19.45,82.65 24.05,82.65 24.4,82.3 24.4,78 22.3,75.9 22.3,74.25 22.65,73.9 23.15,73.9 v23.75,74.5 | v10.6,62.4 8.45,62.4 v8.35,62.3
SD_MOSI  (via drill 0.33)
  Top 0.152: U2.8 18.18,82.75 v16.95,82.75 | v22.9,75.35 22.25,74.7 22.25,73.9 18.3,69.95 18.3,67.8 17.15,66.65 13.05,66.65 v10.6,64.2 | v8.35,64 4.2,59.84 JP2.3
  Bottom 0.152: v16.95,82.75 17.5,83.3 24.35,83.3 24.75,82.9 24.75,77.9 22.9,76.05 v22.9,75.35 | v10.6,64.2 10.4,64 v8.35,64
SD_SCLK  (via drill 0.33)
  Top 0.152: U2.10 19.38,83.78 v19.55,83.95 | v22.9,74.5 22.9,74.1 18.65,69.85 18.65,67.7 17.25,66.3 13.25,66.3 11.8,64.85 11.8,64.5 v10.6,63.3 | v8.35,63.15 2.85,57.65 JP2.5
  Bottom 0.152: v19.55,83.95 24.15,83.95 25.1,83 25.1,77.8 23.55,76.25 23.55,75.15 v22.9,74.5 | v10.6,63.3 10.45,63.15 v8.35,63.15
SENS_SCL  (via drill 0.33)
  Top 0.152: U6.5 4,39 5,38 11,38 | 11,38 12.5,38 15,40.5 15,44.85 16.4,46.25 18.9,46.25 R6.1 21,48.35 21,50.1 v20.85,50.25 | U7.7 10.6,38.4 11,38 | U2.20 13.24,84.86 14.15,83.95 14.15,81.1 v13.7,80.65 | v13.35,75.05 12.9,74.6 10.55,74.6 8.15,72.2 8.15,68.55 10,66.7 10,61.75 18.75,53 20.2,53 v20.8,52.4
  Bottom 0.152: v20.85,50.25 20.8,50.3 v20.8,52.4 | v13.7,80.65 13.7,79.85 13.15,79.3 13.15,76.7 13.7,76.15 13.7,75.65 13.35,75.3 v13.35,75.05
SENS_SDA  (via drill 0.33)
  Top 0.152: U7.6 9.5,39.2 7.4,39.2 7.2,39.4 | U6.6 7,39.2 7.2,39.4 | 7.2,39.4 7.2,44.3 9.25,46.35 12.6,46.35 12.95,46 12.95,45.25 13.2,45 14.65,45 16.25,46.6 18.75,46.6 19.15,47 19.15,48 R11.1 arc-45 20.1,49.12 20,49.22 v20,50.25 | U2.24 11.21,85.44 11.4,85.25 11.95,85.25 13.4,83.8 13.4,82.3 12.9,81.8 12.9,81.35 13.05,81.2 v13.05,80.05 | v13.1,75.9 13.1,75.65 12.4,74.95 10.4,74.95 7.8,72.35 7.8,68.45 9.65,66.6 9.65,61.65 18.9,52.4 v19.95,52.4
  Bottom 0.152: v20,50.25 20,52.35 v19.95,52.4 | v13.05,80.05 12.8,79.8 12.8,76.2 v13.1,75.9
STAT_LED  (via drill 0.33)
  Top 0.152: U1.7 21.3,114.75 v21.7,114.35 | v23.05,113.5 22.65,113.5 20.9,111.75 17.35,111.75 17.05,111.45 16.35,111.45 15.8,112 13.35,112 v12.6,111.25 | v11.05,110.95 10.1,110 6,110 5.75,109.75 4.75,109.75 | 4.75,109.75 3.95,110.55 3.95,118.45 3.4,119 2.45,119 1.57,119.88 D1.2 | 4.75,109.75 5.6,108.9 5.6,108.05 6.45,107.2 6.45,106.25 6.85,105.85 8,105.85 8.35,105.5 8.35,104.15 v8.2,104 | v7.1,103.4 6.65,102.95 6.65,98.9 7.2,98.35 R4.2
  Bottom 0.152: v21.7,114.35 22.2,114.35 v23.05,113.5 | v12.6,111.25 11.35,111.25 v11.05,110.95 | v7.1,103.4 7.7,104 v8.2,104
USB_D+  (via drill 0.33)
  Top 0.152: 11.25,113.2 11.65,112.8 11.65,110.7 9.3,108.35 9.3,103.75 8.7,103.15 8.7,95.95 9.6,95.05 14.5,95.05 14.85,94.7 14.85,92.2 15.4,91.65 15.4,87.3 15.27,87.17 U2.16 | JP3.3 8.85,113 9.45,113.6 10.85,113.6 11.25,113.2 | v11.25,112.65 11.25,113.2 | v12.45,113.3 12.7,113.05 16,113.05 16.3,113.35 18,113.35 18.25,113.6 U1.2
  Bottom 0.152: v12.45,113.3 11.8,112.65 v11.25,112.65
USB_D-
  Top 0.152: 12,112.9 10.95,113.95 8.9,113.95 8.75,113.8 JP3.2 | 12,112.9 12.2,112.7 16.15,112.7 16.45,113 18.15,113 18.75,113.6 U1.3 | 12,112.9 12,110.6 9.65,108.25 9.65,103.65 9.05,103.05 9.05,96.05 9.7,95.4 14.6,95.4 15.2,94.8 15.2,92.3 15.75,91.75 15.75,86.22 U2.15
V_BATT
  Top 0.254: U1.11 U1.12 21.04,117.13 21.21,116.97
  Top 0.762: 21.21,116.97 21.84,116.97 22.48,117.6 23.05,117.6 C22.2 23.75,118.3 23.75,127.65 21.4,130 JP1.2
VBUS  (via drill 0.33)
  Top 0.152: JP3.1 6.1,114.6 5,113.5 v4.9,113.5 | v3.35,113.25 3.35,110.4 5.05,108.7 5.05,107.95 6,107 6,106 7,105 R9.1
  Top 0.254: C7.2 13.95,117.3
  Top 0.279: 13.95,117.3 15.8,117.3 15.9,117.4 16.81,117.4 U1.19
  Top 0.508: 13.65,117 C7.2
  Top 0.762: JP3.1 10.6,114.6 13,117 13.65,117
  Bottom 0.152: v4.9,113.5 3.6,113.5 v3.35,113.25
VSYS  (via drill 0.33)
  Top 0.152: v14.6,109.3 15.15,108.75 17.2,108.75 C33.1 | U3.7 14.3,108 v14.2,108.1
  Top 0.254: L1.2 18,126 | 18,126 18,126.13 13.38,130.75 S1.3 | R1.2 R3.2 6,122 10,126 18,126 | 18.4,109.25 18.4,107.8 18.2,107.6 U3.5 | 24.6,113.5 25,113.1 25,103 23.3,101.3 23.3,98.8 25,97.1 25,81.05 23.2,79.25 23.2,76.8 25,75 25,72.05 | C38.2 29,7.35 29,31.9 27.5,33.4 26.5,33.4 23.1,36.8 v23.1,39.3 | v25.1,39.3 25,39.4 25,72.05 | R14.2 24.95,72 25,72.05
  Top 0.381: 21.6,118.1 21.25,118.45 v21.15,118.45 | v24.43,116.84 24.6,116.67 24.6,113.5 21.05,109.95 | C31.1 22,109.95 21.05,109.95 | 18.4,109.25 C33.1 20.7,109.6 21.05,109.95 | U5.8 30.15,6.2 C38.2
  Top 0.406: U1.13 U1.14
  Top 0.508: 21.65,120.5 21.76,120.61 C28.1 | 22.5,119.65 22.5,119.5 C25.1 22.65,119.15 | U1.13 20.39,117.9
  Top 0.686: 19.6,120.5 21.65,120.5 | 20.39,117.9 21.4,117.9 21.6,118.1 22.65,119.15 | 22.5,119.65 22.5,119.87 21.76,120.61
  Top 0.711: L1.2 18,122.1 19.6,120.5
  Bottom 0.152: v14.2,108.1 14.6,108.5 v14.6,109.3
  Bottom 0.254: v23.1,39.3 v25.1,39.3
  Bottom 0.381: v21.15,118.45 22.76,116.84 v24.43,116.84

### Text on the board
Bottom: 8-20-13
tPlace: BATT | LCD | BUZZER | bar-tailed godwit noun | : a large wader, Limosa | lapponica, of the family | Scolopacidae which, in | migrating from Alaska to New | Zealand, makes the longest | journey without stopping for | food taken by any animal | Godwit v01